# Altium schematic sheet RMII_Ethernet.SchDoc: Thermostat 8CH
size 420 x 297 mm; Author: G.Kasprowicz; CompanyName: WUT ISE; DrawnBy: G.Kasprowicz; Organization: WUT ISE; Address1: PW ISE; Address2: Nowowiejska 15/19 00-665 Warsaw; Address3: gkasprow@gmail.com; DocumentNumber: 7; Revision: 1.0; SheetNumber: 7; SheetTotal: 8; ModifiedBy: -; CheckedDate: -; Title2: Ethernet; DivGrp: WUT ISE; Designer: G.Kasprowicz; ModifiedDate: -; ProjectName: Sensor Box
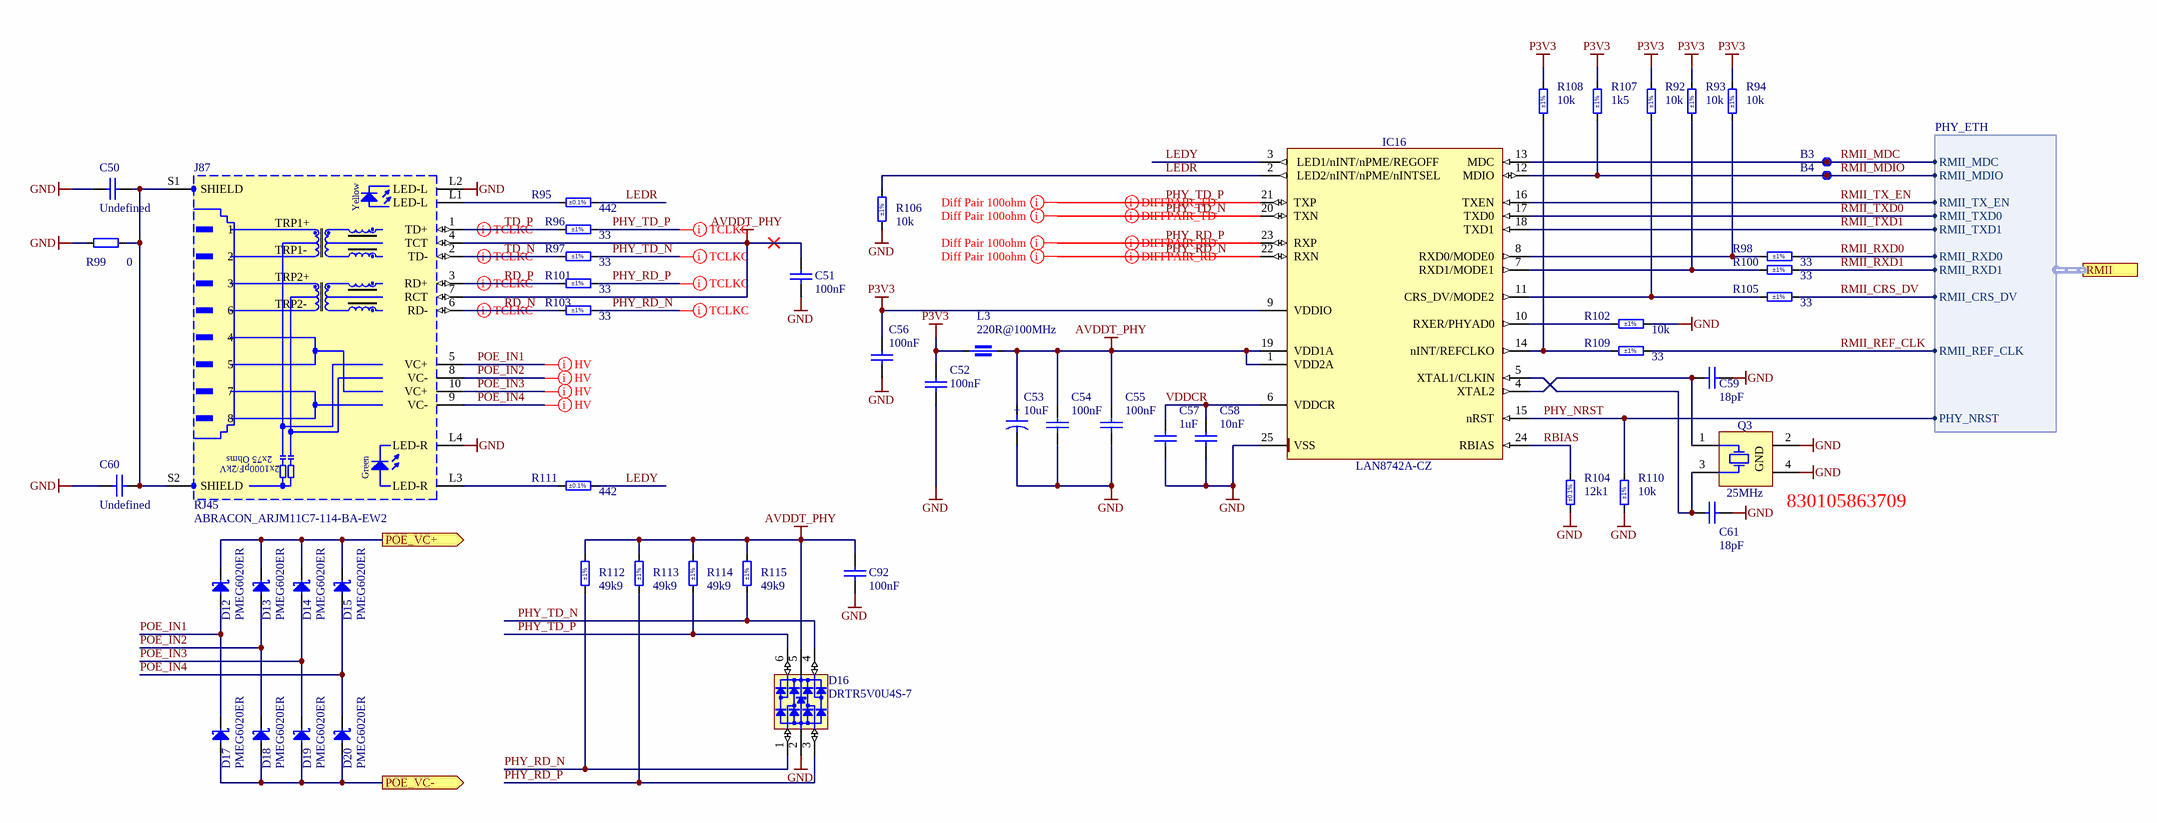
[diagram p0: RMII_Ethernet.SchDoc]

## Parts
B3  SMD Pad  [C100]  (value not drawn)  (no BOM)
B4  SMD Pad  [C100]  (value not drawn)  (no BOM)
C50  Undefined  [CAPC2012X135N]
C51  100nF  [CAPC1608X87N]
C52  100nF  [CAPC1608X87N]
C53  10uF  [CAPMP3216X180N]
C54  100nF  [CAPC1608X87N]
C55  100nF  [CAPC1608X87N]
C56  100nF  [CAPC1608X87N]
C57  1uF  [CAPC1608X87N]
C58  10nF  [CAPC1608X87N]
C59  18pF  [CAPC1608X87N]
C60  Undefined  [CAPC2012X135N]
C61  18pF  [CAPC1608X87N]
C92  100nF  [CAPC1608X87N]
D12  PMEG6020ER  [SODFL3517X110N]
D13  PMEG6020ER  [SODFL3517X110N]
D14  PMEG6020ER  [SODFL3517X110N]
D15  PMEG6020ER  [SODFL3517X110N]
D16  DRTR5V0U4S-7  [SOT65P210X110-6N]
D17  PMEG6020ER  [SODFL3517X110N]
D18  PMEG6020ER  [SODFL3517X110N]
D19  PMEG6020ER  [SODFL3517X110N]
D20  PMEG6020ER  [SODFL3517X110N]
IC16  LAN8742A-CZ  [MICROCHIP_C04-143B]
J87  RJ45  [ABRACON_ARJM11C7-114-BA-EW2]
L3  220R@100MHz  [INDC1608X95N]
Q3  25MHz  [XTAL_TXC_8Y]
R92  10k  Tolerance: ±1%  [RESC1608X55N]
R93  10k  Tolerance: ±1%  [RESC1608X55N]
R94  10k  Tolerance: ±1%  [RESC1608X55N]
R95  442  Tolerance: ±0.1%  [RESC1608X55N]
R96  33  Tolerance: ±1%  [RESC1608X55N]
R97  33  Tolerance: ±1%  [RESC1608X55N]
R98  33  Tolerance: ±1%  [RESC1608X55N]
R99  0  [RESC1608X55N]
R100  33  Tolerance: ±1%  [RESC1608X55N]
R101  33  Tolerance: ±1%  [RESC1608X55N]
R102  10k  Tolerance: ±1%  [RESC1608X55N]
R103  33  Tolerance: ±1%  [RESC1608X55N]
R104  12k1  Tolerance: ±0.1%  [RESC1608X55N]
R105  33  Tolerance: ±1%  [RESC1608X55N]
R106  10k  Tolerance: ±1%  [RESC1608X55N]
R107  1k5  Tolerance: ±1%  [RESC1608X55N]
R108  10k  Tolerance: ±1%  [RESC1608X55N]
R109  33  Tolerance: ±1%  [RESC1608X55N]
R110  10k  Tolerance: ±1%  [RESC1608X55N]
R111  442  Tolerance: ±0.1%  [RESC1608X55N]
R112  49k9  Tolerance: ±1%  [RESC1608X55N]
R113  49k9  Tolerance: ±1%  [RESC1608X55N]
R114  49k9  Tolerance: ±1%  [RESC1608X55N]
R115  49k9  Tolerance: ±1%  [RESC1608X55N]

## Ports
POE_VC+ (out), POE_VC- (out), RMII (harness PHY_ETH)

## Harnesses
PHY_ETH: RMII_TX_EN, RMII_TXD0, RMII_TXD1, RMII_RXD0, RMII_RXD1, RMII_CRS_DV, RMII_MDC, RMII_MDIO, PHY_NRST, RMII_REF_CLK

## Nets
AVDDT_PHY: C51.2 C53.1 C54.2 C55.2 C92.2 D16.5(VBUS) IC16.1(VDD2A) IC16.19(VDD1A) J87.4(TCT) J87.7(RCT) L3.2 R112.2 R113.2 R114.2 R115.2
GND: C50.2 C51.1 C52.1 C53.2 C54.1 C55.1 C56.1 C57.1 C58.1 C59.1 C60.2 C61.1 C92.1 D16.2(GND) IC16.25(VSS) J87.L2(LED-L) J87.L4(LED-R) Q3.2(GND) Q3.4(GND) R99.1 R102.1 R104.2 R106.1 R110.1
P3V3: C52.2 C56.2 IC16.9(VDDIO) L3.1 R92.2 R93.2 R94.2 R107.1 R108.1
LEDR: IC16.2(LED2/nINT/nPME/nINTSEL) R95.2 R106.2
LEDY: IC16.3(LED1/nINT/nPME/REGOFF) R111.2
PHY_NRST: IC16.15(nRST) R110.2 ; port RMII.PHY_NRST
PHY_RD_N: D16.1(I/O1) IC16.22(RXN) R103.1 R112.1
PHY_RD_P: D16.3(I/O2) IC16.23(RXP) R101.1 R113.1
PHY_TD_N: D16.4(I/O3) IC16.20(TXN) R97.1 R115.1
PHY_TD_P: D16.6(I/O4) IC16.21(TXP) R96.1 R114.1
POE_IN1: D12.2(A) D17.1(C) J87.5(VC+)
POE_IN2: D13.2(A) D18.1(C) J87.8(VC-)
POE_IN3: D14.2(A) D19.1(C) J87.10(VC+)
POE_IN4: D15.2(A) D20.1(C) J87.9(VC-)
POE_VC+: D12.1(C) D13.1(C) D14.1(C) D15.1(C) ; port POE_VC+
POE_VC-: D17.2(A) D18.2(A) D19.2(A) D20.2(A) ; port POE_VC-
RBIAS: IC16.24(RBIAS) R104.1
RD_N: J87.6(RD-) R103.2
RD_P: J87.3(RD+) R101.2
RMII_CRS_DV: R105.1 ; port RMII.RMII_CRS_DV
RMII_MDC: B3.1 IC16.13(MDC) ; port RMII.RMII_MDC
RMII_MDIO: B4.1 IC16.12(MDIO) R107.2 ; port RMII.RMII_MDIO
RMII_REF_CLK: R109.1 ; port RMII.RMII_REF_CLK
RMII_RXD0: R98.1 ; port RMII.RMII_RXD0
RMII_RXD1: R100.1 ; port RMII.RMII_RXD1
RMII_TX_EN: IC16.16(TXEN) ; port RMII.RMII_TX_EN
RMII_TXD0: IC16.17(TXD0) ; port RMII.RMII_TXD0
RMII_TXD1: IC16.18(TXD1) ; port RMII.RMII_TXD1
TD_N: J87.2(TD-) R97.2
TD_P: J87.1(TD+) R96.2
VDDCR: C57.2 C58.2 IC16.6(VDDCR)
NetC50_1: C50.1 C60.1 J87.S1(SHIELD) J87.S2(SHIELD) R99.2
NetC59_2: C59.2 IC16.4(XTAL2) Q3.1(X)
NetC61_2: C61.2 IC16.5(XTAL1/CLKIN) Q3.3(X)
NetIC16_7: IC16.7(RXD1/MODE1) R93.1 R100.2
NetIC16_8: IC16.8(RXD0/MODE0) R94.1 R98.2
NetIC16_10: IC16.10(RXER/PHYAD0) R102.2
NetIC16_11: IC16.11(CRS_DV/MODE2) R92.1 R105.2
NetIC16_14: IC16.14(nINT/REFCLKO) R108.2 R109.2
NetJ87_L1: J87.L1(LED-L) R95.1
NetJ87_L3: J87.L3(LED-R) R111.1

## Layout directives
differential pair: PHY_RD_N, PHY_RD_P, PHY_TD_N, PHY_TD_P, RD_N, RD_P, TD_N, TD_P
net class HV: POE_IN1, POE_IN2, POE_IN3, POE_IN4
rule Matched Net Lengths [Tolerance = 100mil]: PHY_RD_N, PHY_RD_P, PHY_TD_N, PHY_TD_P

## Notes on the sheet
- (near Q3) 830105863709
- Project/Equipment
- Document
- Designer
- Drawn by
- Check.by
- Copyright WUT ISE 2020.
  This documentation describes Open Hardware and is licensed under the CERN OHL v.1.2. You may redistribute and modify this documentation under the terms of the CERN OHL v.1.2. (http://ohwr.org/CERNOHL). This documentation is distributed WITHOUT ANY EXPRESS OR IMPLIED WARRANTY, INCLUDING OF MERCHANTABILITY, SATISFACTORY QUALITY AND FITNESS FOR A PARTICULAR PURPOSE. Please see the CERN OHL v.1.2 for applicable conditions.
- Contact
- File
- Last Mod.
- Print Date
- Sheet
- Size
- A3
- of
- Rev
- (in symbol CON_ETH_POE_ARJM11C7) Yellow; TRP1+; TRP1-; TRP2+; TRP2-; 2x75 Ohms; Green; 2x1000pF/2kV
- (in symbol CTE3216-18_10UF_16V_20%_AVX_TCJ) +

## Library data of the parts
B3 B4 = SMD_PAD_D1MM: Pad; Part Description: 1mm Diameter SMD Pad; Mounted: No; Part Number: SMD_PAD_D1MM; Component Type: Standard (No BOM); Pin Count: 1; Family: SMD Pad; Socket: No; SMD: Yes; Sense: No; Status: None; ComponentHeight: 0mm; HelpURL: Undefined; Author: CERN DEM JLC; CreateDate: 10.10.2017; LatestRevisionDate: 10.10.2017; PackageDescription: 1mm Diameter SMD Pad
C50 C60 = CC0805_NO-VALUE: Non-polarised capacitor; Part Description: Reserved Footprint For 0805(2012) Chip Ceramic Capacitor; Mounted: No; Part Number: CC0805_NO-VALUE; Component Kind: Standard; Component Type: Standard; Pin Count: 2; Value: Undefined; Status: None; Manufacturer: Undefined; Manufacturer Part Number: CC0805_NO-VALUE; Case: 0805; Socket: No; SMD: Yes; Sense: No; Manufacturer1 ComponentHeight: 1.35mm; HelpURL: Undefined; Author: CERN DEM JLC; CreateDate: 10.12.2008; LatestRevisionDate: 11.09.2013
C51 C52 C54-C56 C92 = CC0603_100NF_50V_10%_X7R: Non-polarised capacitor; Part Description: SMD Multilayer Chip Ceramic Capacitor; Manufacturer: GENERIC; Manufacturer1 Part Number: 223858615649; Voltage: 50V; TC: X7R; Tolerance: ±10%; Part Number: CC0603_100NF_50V_10%_X7R; Component Kind: Standard; Component Type: Standard; Pin Count: 2; Value: 100nF; Status: Preferred; Manufacturer Part Number: CC0603_100NF_50V_10%_X7R; Case: 0603; Mounted: Yes; Socket: No; SMD: Yes; Sense: No; Manufacturer1 Example: PHYCOMP; Manufacturer1 ComponentHeight: 0.87mm; HelpURL: \\cern.ch\dfs\Applications\Altium\Datasheets\CC0603_X7R_PHYCOMP.pdf; Author: CERN DEM JLC; CreateDate: 03.12.2007; LatestRevisionDate: 03.12.2007
C53 = CTE3216-18_10UF_16V_20%_AVX_TCJ: Polarised capacitor; Part Description: ESR 0R200 Tantalum Solid Electrolytic Chip Capacitor with Conductive Polymer Electrode; Manufacturer: AVX; Manufacturer Part Number: TCJA106M016R0200; Voltage: 16V; Tolerance: ±20%; Part Number: CTE3216-18_10UF_16V_20%_AVX_TCJ; Component Kind: Standard; Component Type: Standard; Pin Count: 2; Value: 10uF; Status: Preferred; Case: A; Mounted: Yes; Socket: No; SMD: Yes; Sense: No; ComponentHeight: 1.8mm; HelpURL: \\cern.ch\dfs\Applications\Altium\Datasheets\CTE_AVX_TCJ.pdf; Author: CERN DEM JLC; CreateDate: 29.03.2012; LatestRevisionDate: 29.03.2012
C57 = CC0603_1UF_16V_10%_X7R: Non-polarised capacitor; Part Description: SMD Multilayer Chip Ceramic Capacitor; Manufacturer: GENERIC; Manufacturer1 Part Number: 223878615663; Voltage: 16V; TC: X7R; Tolerance: ±10%; Part Number: CC0603_1UF_16V_10%_X7R; Component Kind: Standard; Component Type: Standard; Pin Count: 2; Value: 1uF; Status: None; Manufacturer Part Number: CC0603_1UF_16V_10%_X7R; Case: 0603; Mounted: Yes; Socket: No; SMD: Yes; Sense: No; Manufacturer1 Example: YAGEO PHYCOMP; Manufacturer1 ComponentHeight: 0.9mm; HelpURL: \\cern.ch\dfs\Applications\Altium\Datasheets\CC0603_X7R_PHYCOMP.pdf; Author: CERN DEM JLC; CreateDate: 03.12.2007; LatestRevisionDate: 17.04.2015
C58 = CC0603_10NF_50V_10%_X7R: Non-polarised capacitor; Part Description: SMD Multilayer Chip Ceramic Capacitor; Manufacturer: GENERIC; Manufacturer1 Part Number: 223858615636; Voltage: 50V; TC: X7R; Tolerance: ±10%; Part Number: CC0603_10NF_50V_10%_X7R; Component Kind: Standard; Component Type: Standard; Pin Count: 2; Value: 10nF; Status: Preferred; Manufacturer Part Number: CC0603_10NF_50V_10%_X7R; Case: 0603; Mounted: Yes; Socket: No; SMD: Yes; Sense: No; Manufacturer1 Example: PHYCOMP; Manufacturer1 ComponentHeight: 0.87mm; HelpURL: \\cern.ch\dfs\Applications\Altium\Datasheets\CC0603_X7R_PHYCOMP.pdf; Author: CERN DEM JLC; CreateDate: 03.12.2007; LatestRevisionDate: 03.12.2007
C59 C61 = CC0603_18PF_50V_5%_NP0: Non-polarised capacitor; Part Description: SMD Multilayer Chip Ceramic Capacitor; Manufacturer: GENERIC; Manufacturer1 Part Number: 223886715189; Voltage: 50V; TC: C0G/NP0; Tolerance: ±5%; Part Number: CC0603_18PF_50V_5%_NP0; Component Kind: Standard; Component Type: Standard; Pin Count: 2; Value: 18pF; Status: Preferred; Manufacturer Part Number: CC0603_18PF_50V_5%_NP0; Case: 0603; Mounted: Yes; Socket: No; SMD: Yes; Sense: No; Manufacturer1 Example: PHYCOMP; Manufacturer1 ComponentHeight: 0.87mm; HelpURL: \\cern.ch\dfs\Applications\Altium\Datasheets\CC0603_NP0_PHYCOMP.pdf; Author: CERN DEM JLC; CreateDate: 03.12.2007; LatestRevisionDate: 03.12.2007
D12-D15 D17-D20 = PMEG6020ER: Schottky Diode; Part Description: MEGA Schottky Barrier Rectifier; Manufacturer: NXP SEMICONDUCTORS; Voltage: 60V; Power: 2A; PressFit: No; Bonding: No; Part Number: PMEG6020ER; Component Kind: Standard; Component Type: Standard; Device: PMEG6020ER; PackageDescription: SODFL Diode (SOD123W); 2.60mm W X 1.70mm L X 1.10mm H body, IPC Medium Density; Manufacturer Part Number: PMEG6020ER; Pin Count: 2; Case: SOD-123FL; Mounted: Yes; Socket: No; SMD: Yes; Sense: No; ComponentHeight: 1.1mm; HelpURL: \\cern.ch\dfs\Applications\Altium\Datasheets\PMEG6020ER.pdf; Author: CERN DEM JMW; CreateDate: 19.06.2014; LatestRevisionDate: 19.06.2014
D16 = D_TVS_DRTR5V0U4S-7: Integrated Quad Ultra-Low Capacitance ESD Protection; Part Description: Integrated Quad Ultra-Low Capacitance ESD (±8kV) Protection; Manufacturer: DIODES; PressFit: No; Bonding: No; Status Comment: Active; Part Number: DRTR5V0U4S-7; Component Kind: Standard; Component Type: Standard; Device: DRTR5V0U4S-7; PackageDescription: SOT363, SC70-6, 0.65mm Pitch; 6 Pin, 1.25mm W X 2.00mm L X 1.10mm H body, IPC Medium Density; Status: Active; Manufacturer Part Number: DRTR5V0U4S-7; Pin Count: 6; Case: SOT363; Mounted: Yes; Socket: No; SMD: Yes; Sense: No; ComponentHeight: 1.1mm; HelpURL: \\cern.ch\dfs\Applications\Altium\Datasheets\PRTR5V0U4Y.pdf; Author: GK; CreateDate: 24.01.2017; LatestRevisionDate: 14.09.2020
IC16 = LAN8742A-CZ: 10/100 Base-T/TX Ethernet Transceiver with Cable Diagnostics; Manufacturer: MICROCHIP TECHNOLOGY; PressFit: No; Bonding: No; Part Number: LAN8742A-CZ; Component Kind: Standard; Component Type: Standard; Device: LAN8742A-CZ; PackageDescription: QFN 24 Pin, MICROCHIP Package C04-143B 0.50mm Pitch, Square; 24 Pin, 4.00mm L X 4.00mm W X 0.90mm H body (w/Thermal Tab 2.60 X 2.60mm),; Part Description: 10/100 Base-T/TX Ethernet Transceiver with Cable Diagnostics; Manufacturer Part Number: LAN8742A-CZ; Pin Count: 25; Case: QFN24; Mounted: Yes; Socket: No; SMD: Yes; Sense: No; ComponentHeight: 0.9mm; Author: CERN DEM HF; HelpURL: \\cern.ch\dfs\Applications\Altium\Datasheets\LAN8742AX.pdf; CreateDate: 26.10.2022; LatestRevisionDate: 26.10.2022
J87 = CON_ETH_POE_ARJM11C7: MagJack 10/100BaseT, PoE+, 1X1, OG/Y, -40 to 85*C, Tab Up, RoHS; Part Number: 5-2337992-3; Part Description: 1 Port, Orange Green/Yellow LEDs, RJ45 10/100BaseT, PoE, Ethernet MagJack® Connector Module; Manufacturer: TE; PressFit: No; Component Kind: Standard; Component Type: Standard; Pin Count: 18; Family: RJ45; Mounted: Yes; Socket: No; SMD: No; Sense: No; Status: None; Manufacturer Part Number: 5-2337992-3; ComponentHeight: 13.61mm; HelpURL: \\cern.ch\dfs\Applications\Altium\Datasheets\BELFUSE_0826-1X1T-GJ-F.pdf; Author: GK; CreateDate: 05.11.2012; LatestRevisionDate: 05.11.2012
L3 = IND0603_MURATA_BLM18SG221TN1: Part Description: SMD EMIFIL Suppression Chip Ferrite Bead; Manufacturer: MURATA; Power: 2.5A; Resistance: 0.04R; Tolerance: ±25%; Part Number: IND0603_MURATA_BLM18SG221TN1; Component Kind: Standard; Component Type: Standard; Pin Count: 2; Value: 220R@100MHz; Manufacturer Part Number: BLM18SG221TN1; Case: 0603; Mounted: Yes; Socket: No; SMD: Yes; Sense: No; ComponentHeight: 0.95mm; HelpURL: \\cern.ch\dfs\Applications\Altium\Datasheets\IND0603_MURATA_BLM18S.pdf; Author: CERN DEM MR; CreateDate: 08.01.2016; LatestRevisionDate: 25.10.2018
Q3 = XTAL_25MHZ_TXC_8Y-25.000MAAJ-T: Crystal 4 pins 1=XTAL Control 2=GND3=XTAL 4=GND; Part Description: ±30ppm, 18pF, -20°C to +70°C  4 Pins, 2x1.6X0.5mm, SMD Seam Sealing Crystal, 8Y Serie; Manufacturer: TXC CORPORATION; PressFit: No; Bonding: No; Part Number: XTAL_25MHZ_TXC_8Y-25.000MAAJ-T; Component Kind: Standard; Component Type: Standard; PackageDescription: 4 Pins, 2x1.6X0.5mm, SMD Seam Sealing Crystal, 8Y Serie; Value: 25MHz; Manufacturer Part Number: 8Y-25.000MAAJ-T; Pin Count: 4; Mounted: Yes; Socket: No; SMD: Yes; Sense: No; ComponentHeight: 13.6mm; HelpURL: \\cern.ch\dfs\Applications\Altium\Datasheets\XTAL_TXC_8Y.pdf; Author: CERN DEM JLC; CreateDate: 08.03.2012; LatestRevisionDate: 08.03.2012
R92-R94 R102 R106 R108 R110 = R0603_10K_1%_0.1W_100PPM: Resistor - 1%; Part Description: General Purpose Thick Film Chip Resistor; Manufacturer: GENERIC; Manufacturer1 Part Number: NRC06F1002TRF; Power: 0.1W; TC: ±100ppm/°C; PressFit: No; Part Number: R0603_10K_1%_0.1W_100PPM; Component Kind: Standard; Component Type: Standard; Pin Count: 2; Value: 10k; Status: Preferred; Manufacturer Part Number: R0603_10K_1%_0.1W_100PPM; Case: 0603; Mounted: Yes; Sense: No; Socket: No; SMD: Yes; Manufacturer1 Example: NIC COMPONENT; Manufacturer1 ComponentHeight: 0.55mm; HelpURL: \\cern.ch\dfs\Applications\Altium\Datasheets\R0603_NIC_NRC.pdf; Author: CERN DEM JLC; CreateDate: 03.12.2007; LatestRevisionDate: 13.03.2008
R95 R111 = R0603_442R_0.1%_0.063W_10PPM: Resistor - 0.1%; Part Description: Thin Film Chip Resistor; Manufacturer: GENERIC; Manufacturer1 Part Number: RN73C1J442RBTDF; Power: 0.063W; TC: ±10ppm; PressFit: No; Part Number: R0603_442R_0.1%_0.063W_10PPM; Component Kind: Standard; Component Type: Standard; Pin Count: 2; Value: 442; Status: Not Recommended; Manufacturer Part Number: R0603_442R_0.1%_0.063W_10PPM; Case: 0603; Mounted: Yes; Sense: No; Socket: No; SMD: Yes; Manufacturer1 Example: TYCO HOLSWORTHY; Manufacturer1 ComponentHeight: 0.5mm; HelpURL: \\cern.ch\dfs\Applications\Altium\Datasheets\R0603_Tyco_RN73.pdf; Author: CERN DEM JLC; CreateDate: 03.12.2007; LatestRevisionDate: 13.03.2008
R96-R98 R100 R101 R103 R105 R109 = R0603_33R_1%_0.1W_100PPM: Resistor - 1%; Part Description: General Purpose Thick Film Chip Resistor; Manufacturer: GENERIC; Manufacturer1 Part Number: NRC06F33R0TRF; Power: 0.1W; TC: ±100ppm/°C; PressFit: No; Part Number: R0603_33R_1%_0.1W_100PPM; Component Kind: Standard; Component Type: Standard; Pin Count: 2; Value: 33; Status: Preferred; Manufacturer Part Number: R0603_33R_1%_0.1W_100PPM; Case: 0603; Mounted: Yes; Sense: No; Socket: No; SMD: Yes; Manufacturer1 Example: NIC COMPONENT; Manufacturer1 ComponentHeight: 0.55mm; HelpURL: \\cern.ch\dfs\Applications\Altium\Datasheets\R0603_NIC_NRC.pdf; Author: CERN DEM JLC; CreateDate: 03.12.2007; LatestRevisionDate: 13.03.2008
R99 = R0603_0R_JUMPER: Resistor; Part Description: 1A (0.05R Max DC Resistance) Zero Ohm Jumper; Manufacturer: GENERIC; Manufacturer1 Part Number: NRC06Z0; PressFit: No; Part Number: R0603_0R_JUMPER; Component Kind: Standard; Component Type: Standard; Pin Count: 2; Value: 0; Status: Preferred; Manufacturer Part Number: R0603_0R_JUMPER; Case: 0603; Mounted: Yes; Sense: No; Socket: No; SMD: Yes; Manufacturer1 Example: NIC COMPONENT; Manufacturer1 ComponentHeight: 0.55mm; HelpURL: \\cern.ch\dfs\Applications\Altium\Datasheets\R0603_NIC_NRC.pdf; Author: CERN DEM JLC; CreateDate: 03.12.2007; LatestRevisionDate: 13.03.2008
R104 = R0603_12K1_0.1%_0.063W_10PPM: Resistor - 0.1%; Part Description: Thin Film Chip Resistor; Manufacturer: GENERIC; Manufacturer1 Part Number: RN73C1J12K1BTDF; Power: 0.063W; TC: ±10ppm; PressFit: No; Part Number: R0603_12K1_0.1%_0.063W_10PPM; Component Kind: Standard; Component Type: Standard; Pin Count: 2; Value: 12k1; Status: Not Recommended; Manufacturer Part Number: R0603_12K1_0.1%_0.063W_10PPM; Case: 0603; Mounted: Yes; Sense: No; Socket: No; SMD: Yes; Manufacturer1 Example: TYCO HOLSWORTHY; Manufacturer1 ComponentHeight: 0.5mm; HelpURL: \\cern.ch\dfs\Applications\Altium\Datasheets\R0603_Tyco_RN73.pdf; Author: CERN DEM JLC; CreateDate: 03.12.2007; LatestRevisionDate: 13.03.2008
R107 = R0603_1K5_1%_0.1W_100PPM: Resistor - 1%; Part Description: General Purpose Thick Film Chip Resistor; Manufacturer: GENERIC; Manufacturer1 Part Number: NRC06F1501TRF; Power: 0.1W; TC: ±100ppm/°C; PressFit: No; Part Number: R0603_1K5_1%_0.1W_100PPM; Component Kind: Standard; Component Type: Standard; Pin Count: 2; Value: 1k5; Status: Preferred; Manufacturer Part Number: R0603_1K5_1%_0.1W_100PPM; Case: 0603; Mounted: Yes; Sense: No; Socket: No; SMD: Yes; Manufacturer1 Example: NIC COMPONENT; Manufacturer1 ComponentHeight: 0.55mm; HelpURL: \\cern.ch\dfs\Applications\Altium\Datasheets\R0603_NIC_NRC.pdf; Author: CERN DEM JLC; CreateDate: 03.12.2007; LatestRevisionDate: 13.03.2008
R112-R115 = R0603_49K9_1%_0.1W_100PPM: Resistor - 1%; Part Description: General Purpose Thick Film Chip Resistor; Manufacturer: GENERIC; Manufacturer1 Part Number: CRCW060349K9FKEA; Power: 0.1W; TC: ±100ppm/°C; PressFit: No; Part Number: R0603_49K9_1%_0.1W_100PPM; Component Kind: Standard; Component Type: Standard; Pin Count: 2; Value: 49k9; Status: Preferred; Manufacturer Part Number: R0603_49K9_1%_0.1W_100PPM; Case: 0603; Mounted: Yes; Sense: No; Socket: No; SMD: Yes; Manufacturer1 Example: VISHAY; Manufacturer1 ComponentHeight: 0.55mm; HelpURL: \\cern.ch\dfs\Applications\Altium\Datasheets\R0603_VISHAY_CRCW e3.pdf; Author: CERN DEM JLC; CreateDate: 16.11.2017; LatestRevisionDate: 16.11.2017